# Altium schematic sheet block_diagram.SchDoc
size A4
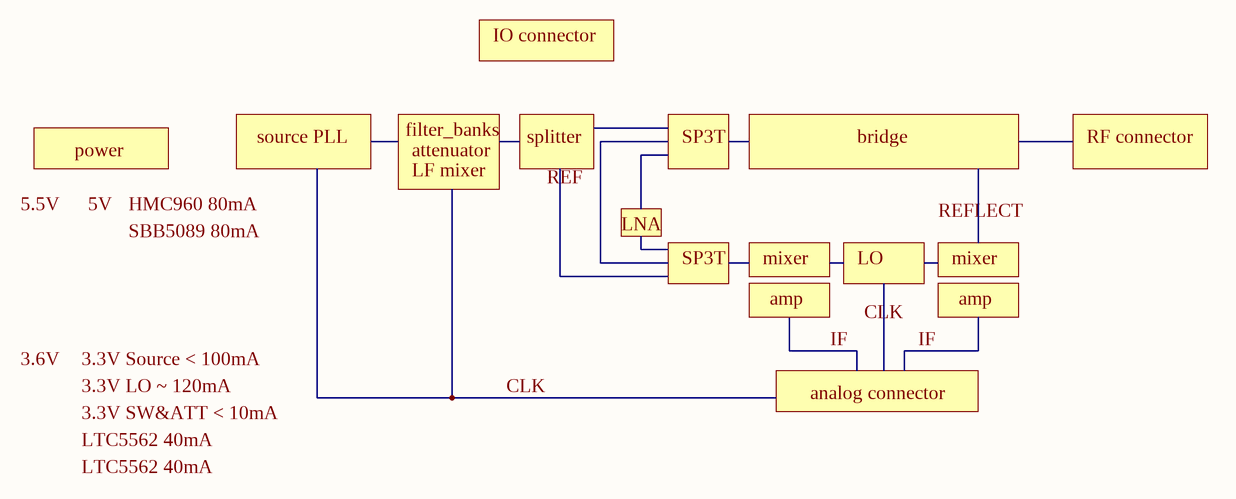
[diagram p0: block_diagram.SchDoc]

## Notes on the sheet
- IO connector
- power
- source PLL
- filter_banks
- attenuator
- LF mixer
- splitter
- REF
- SP3T
- bridge
- RF connector
- 5.5V
- 5V
- HMC960 80mA
- SBB5089 80mA
- LNA
- mixer
- LO
- REFLECT
- amp
- CLK
- 3.6V
- 3.3V Source < 100mA
- 3.3V LO ~ 120mA
- analog connector
- IF
- LTC5562 40mA
- 3.3V SW&ATT < 10mA